# EAGLE design Strombegrenzung_RevA (EAGLE 7.4.0)
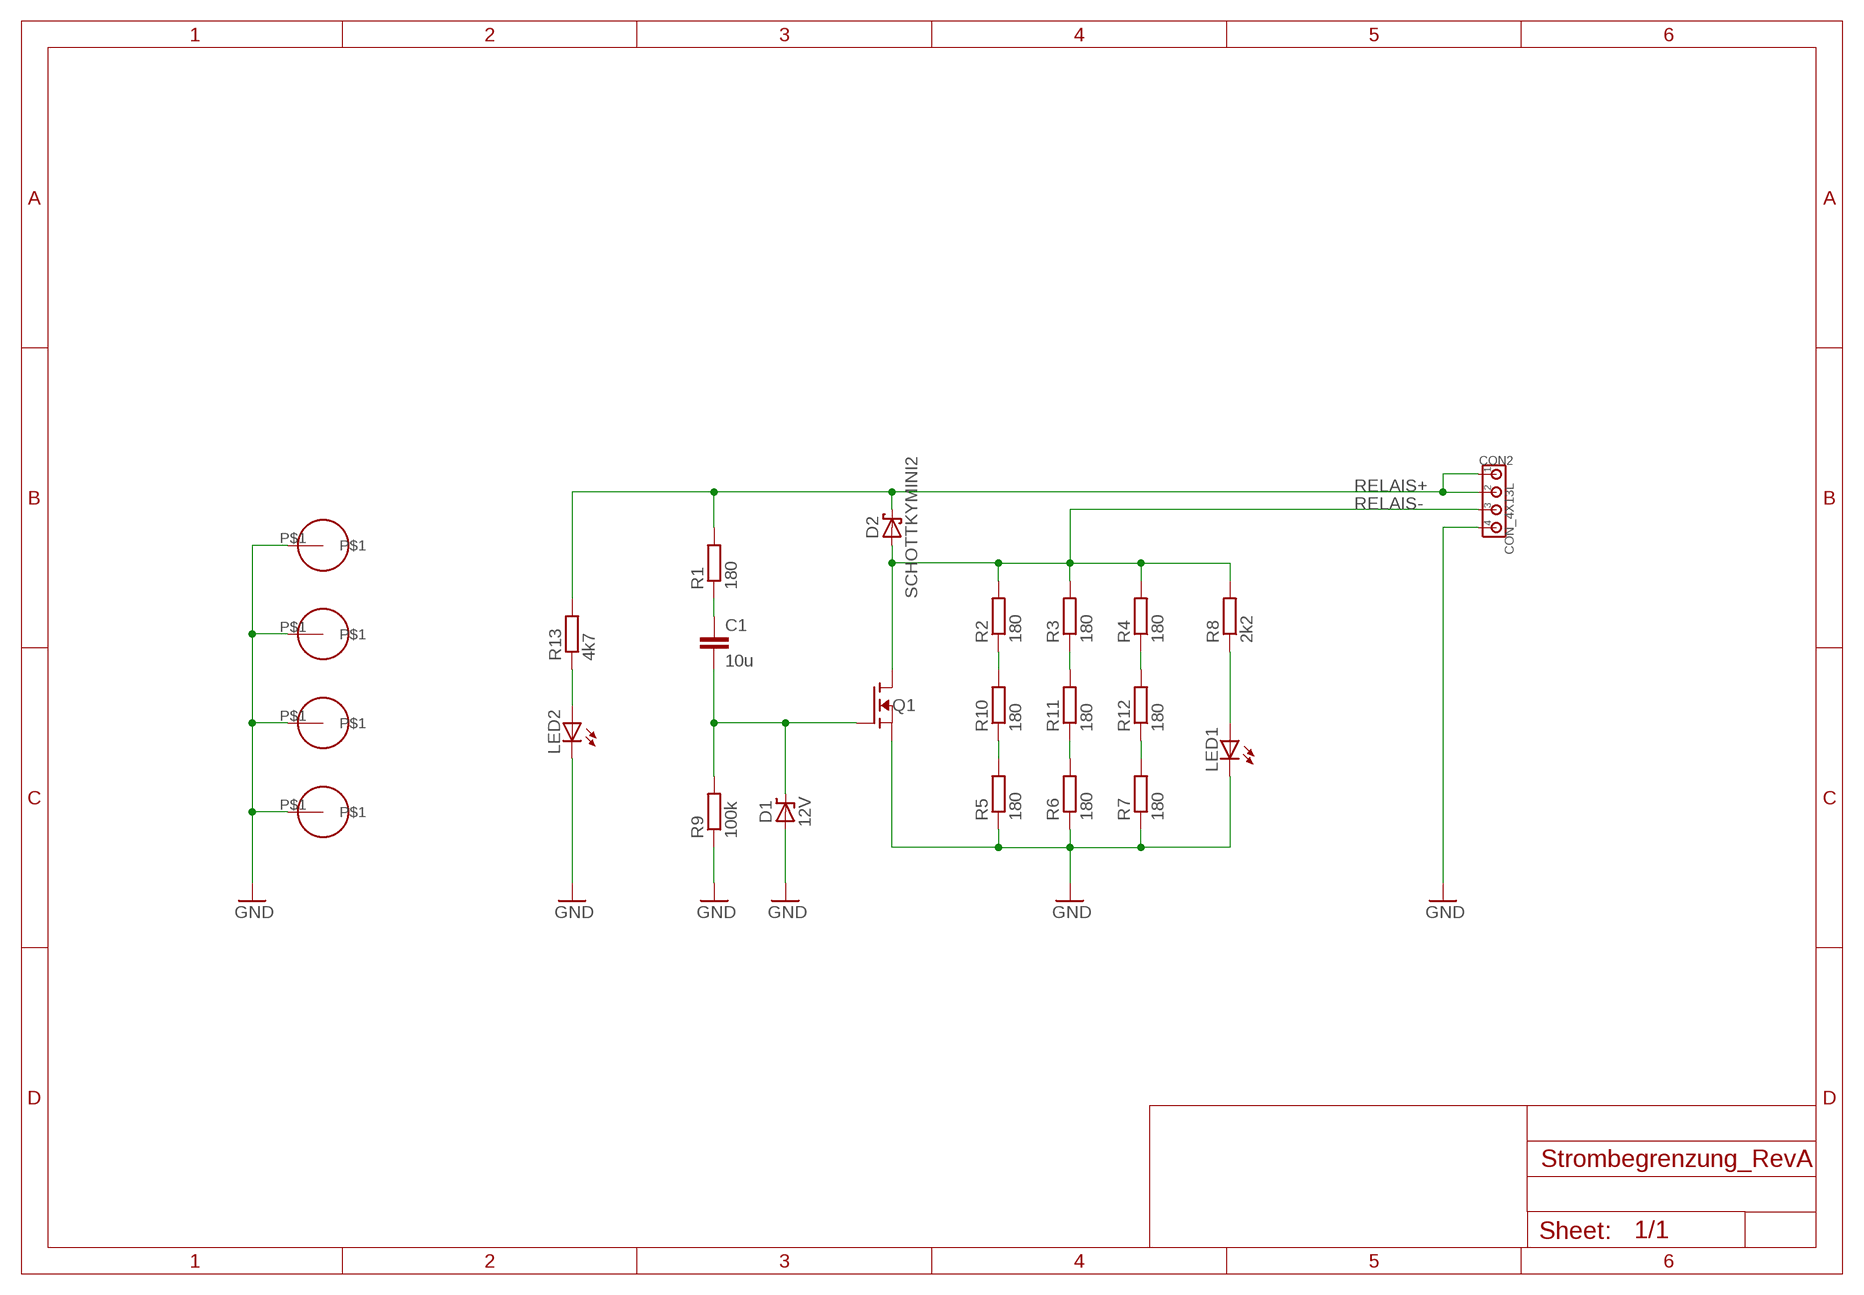
[diagram p0: schematic, sheet 1]

## Parts
C1  10u  CC1206  [C1206]
CON2  CON_4X13L  [200MIL_4X]
D1  12V  ZENERSOD323  [SOD323]
D2  SCHOTTKYMINI2  [MINI2-F3-B]
LED1  LED0805  [LED0805]
LED2  LED0805  [LED0805]
Q1  N-FETSOT23  [SOT23]
R1  180  RESISTORR0805  [R0805]
R2  180  RESISTORR0805  [R0805]
R3  180  RESISTORR0805  [R0805]
R4  180  RESISTORR0805  [R0805]
R5  180  RESISTORR0805  [R0805]
R6  180  RESISTORR0805  [R0805]
R7  180  RESISTORR0805  [R0805]
R8  2k2  RESISTORR0805  [R0805]
R9  100k  RESISTORR0805  [R0805]
R10  180  RESISTORR0805  [R0805]
R11  180  RESISTORR0805  [R0805]
R12  180  RESISTORR0805  [R0805]
R13  4k7  RESISTORR0805  [R0805]
U$1  HOLE_3.3MM  [HOLE_3.3MM]
U$2  HOLE_3.3MM  [HOLE_3.3MM]
U$3  HOLE_3.3MM  [HOLE_3.3MM]
U$4  HOLE_3.3MM  [HOLE_3.3MM]

## Nets
GND: CON2.4 D1.A LED1.C LED2.C Q1.2(S) R5.1 R6.1 R7.1 R9.1 U$1.P$1 U$2.P$1 U$3.P$1 U$4.P$1
N$1: C1.1 R1.1
N$2: R2.1 R10.2
N$3: C1.2 D1.C Q1.1(G) R9.2
N$4: R5.2 R10.1
N$5: LED1.A R8.1
N$6: R6.2 R11.1
N$7: LED2.A R13.1
N$8: R3.1 R11.2
N$9: R4.1 R12.2
N$10: R7.2 R12.1
RELAIS+: CON2.1 CON2.2 D2.C R1.2 R13.2
RELAIS-: CON2.3 D2.A Q1.3(D) R2.2 R3.2 R4.2 R8.2

## Library data of the parts
C1 = 00Capacitor:C: Capacitor
CON2 = 00Connector:CON_4X: 4-pin header
D1 = 00Diode:ZENER
D2 = 00Diode:SCHOTTKY
LED1 LED2 = 00Display:LED: LED
Q1 = 00Mosfet:N-FET: N-Channel MOSFET
R1-R13 = 00Resistor:RESISTOR: RESISTOR, European symbol
U$1-U$4 = 00Drill:HOLE_3.3MM

## Board
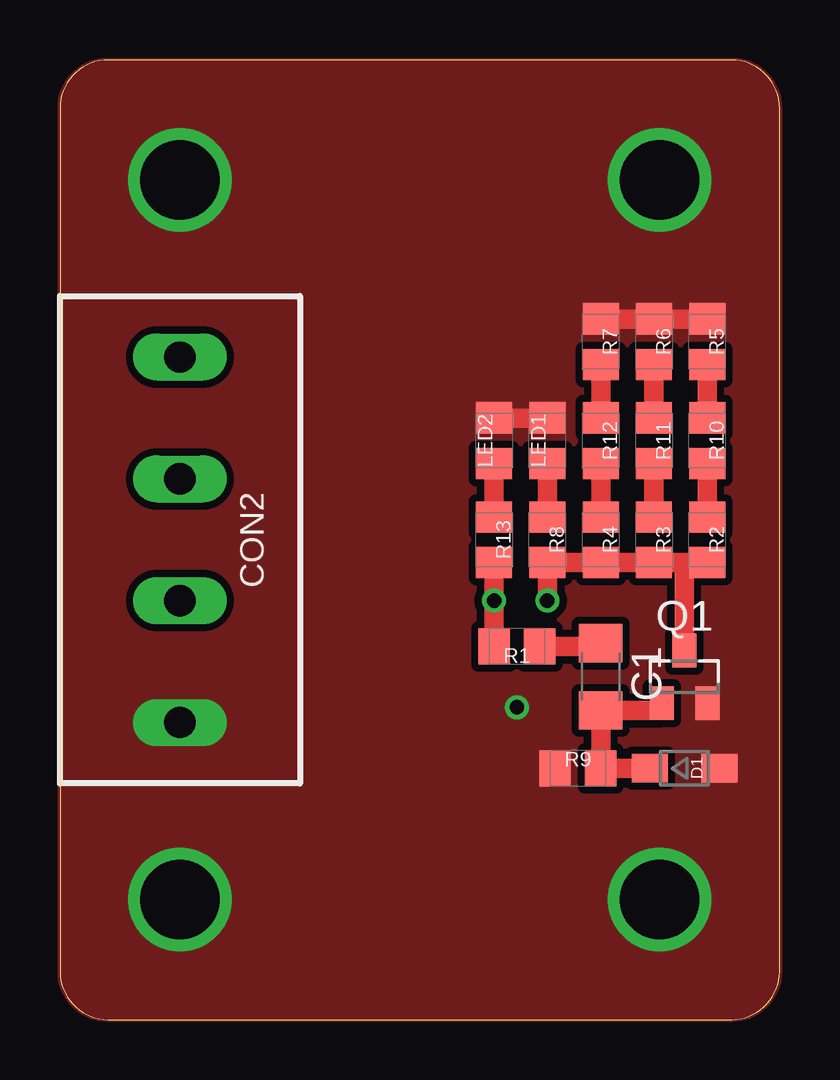
[diagram p1: board, top side]
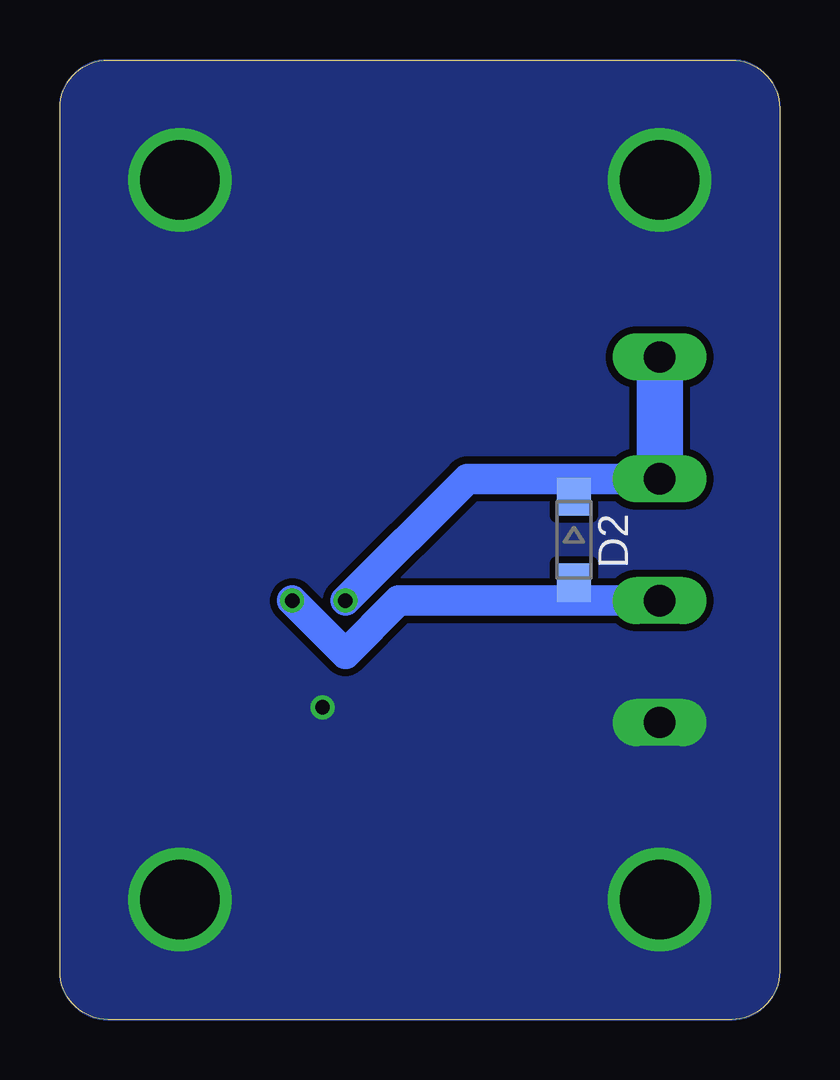
[diagram p2: board, bottom side, seen from below]

Size 30 x 40 mm. Coordinates in mm from the lower left corner, seen from the top.
Outline: 2,0 28,0 arc90 30,2 30,38 arc90 28,40 2,40 arc90 0,38 0,2 arc90 2,0
Copper layers (1*16): Top 0.035mm / dielectric 1.5mm / Bottom 0.035mm
Design rules "default *": minimum track width 10mil, minimum drill 24mil, track to track 8mil, track to pad 8mil, pad to pad 8mil, via to via 8mil, smd to smd 8mil, copper to edge 0mil, drill to drill 8mil, minimum pad ring 10mil, minimum via ring 8mil, stop-mask expansion 4mil, vias tented up to drill 0mil, thermal gap 10mil

### Footprints (pad centres in the part's own frame; a part is rotated, then mirrored left to right if it is on the bottom)
C1206 = smd 1.6 x 1.8: 1 -1.4,0; 2 1.4,0
200MIL_4X = drill 1.3 long: 1 -7.62,0; 2 -2.54,0; 3 2.54,0; 4 7.62,0
SOD323 = smd 1.5 x 1.2: A 1.45,0; C -1.45,0
MINI2-F3-B = smd 1.6 x 1.4: A 1.8,0; C -1.8,0
LED0805 = smd 1.3 x 1.5: A -0.95,0; C 0.95,0
SOT23 = smd 1 x 1.4: 1 -0.95,-1.1; 2 0.95,-1.1; 3 0,1.1
R0805 = smd 1.3 x 1.5: 1 -0.95,0; 2 0.95,0
HOLE_3.3MM = drill 3.3: P$1 0,0

### Placement (x,y rotation side)
C1  22.54,14.29 270 top
CON2  5,20 270 top
D1  26.04,10.48 0 top
D2  8.57,20 270 bottom
LED1  20.32,24.13 90 top
LED2  18.1,24.13 90 top
Q1  26.04,14.29 0 top
R1  19.05,15.56 180 top
R2  26.99,20 270 top
R3  24.77,20 270 top
R4  22.54,20 270 top
R5  26.99,28.26 270 top
R6  24.77,28.26 270 top
R7  22.54,28.26 270 top
R8  20.32,20 270 top
R9  21.59,10.48 0 top
R10  26.99,24.13 270 top
R11  24.77,24.13 270 top
R12  22.54,24.13 270 top
R13  18.1,20 270 top
U$1  5,35 0 top
U$2  5,5 0 top
U$3  25,35 0 top
U$4  25,5 0 top

### Tracks (layer width: path | path; a pad name or v marks a point on that pad's centre or on a via)
GND  (via drill 0.6)
  Top 0.813: LED2.C LED1.C | R5.1 R6.1 R7.1
  other vias: 19.05,13.02
  pour Top (isolate 0.305, no thermals): 0,2 0,38 arc-90 2,40 28,40 arc-90 30,38 30,2 arc-90 28,0 2,0 arc-90
  pour Bottom (isolate 0.305, no thermals): 0,30 0,38 arc-90 2,40 15,40 28,40 arc-90 30,38 30,20 30,2 arc-90 28,0 15,0 2,0 arc-90 0,2
N$1
  Top 0.61: 22.23,15.56 C1.1
  Top 0.813: R1.1 22.23,15.56
N$2
  Top 0.813: R2.1 R10.2
N$3
  Top 0.61: 25.09,12.89 Q1.1
  Top 0.813: 25.09,12.89 C1.2 R9.2 D1.C
N$4
  Top 0.813: R10.1 R5.2
N$5
  Top 0.813: LED1.A R8.1
N$6
  Top 0.813: R6.2 R11.1
N$7
  Top 0.813: R13.1 LED2.A
N$8
  Top 0.813: R3.1 R11.2
N$9
  Top 0.813: R12.2 R4.1
N$10
  Top 0.813: R7.2 R12.1
RELAIS+  (via drill 0.6)
  Top 0.61: R1.2
  Top 0.813: R1.2 v18.1,17.46 R13.2
  Bottom 1.27: CON2.2 8.57,22.54 | 8.57,22.54 13.02,22.54 v18.1,17.46 | D2.C 8.57,22.54
  Bottom 1.93: CON2.2 CON2.1
RELAIS-  (via drill 0.6)
  Top 0.61: R4.2 R3.2
  Top 0.813: 26.04,19.05 R3.2 R8.2 v20.32,17.46 | R2.2 26.04,19.05 | Q1.3 26.04,19.05
  Bottom 1.27: v20.32,17.46 18.1,15.24 15.88,17.46 8.57,17.46 | 8.57,17.46 CON2.3 | D2.A 8.57,17.46

### Text on the board
tText: IN | R+ | R- | GND